# Altium schematic sheet Multiplexed_Row.SchDoc: Multiplexed Row
size A4; DrawnBy: Brandon Skarka; Revision: 0; SheetNumber: 2; SheetTotal: 3
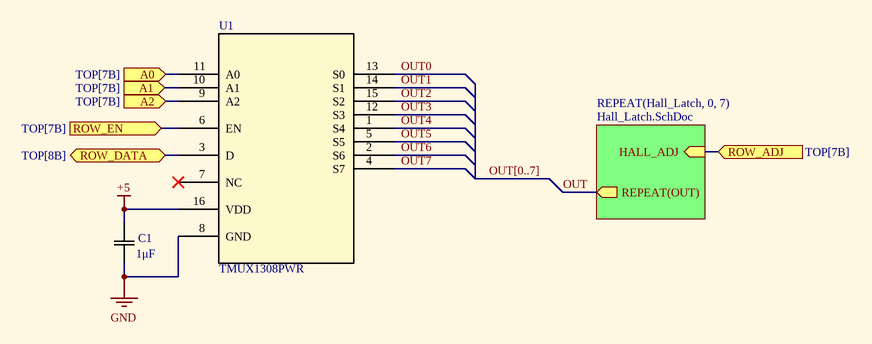
[diagram p0: Multiplexed_Row.SchDoc]

## Parts
C1  1μF  [CAP_CL10_SAM]
U1  TMUX1308PWR  [TSSOP16_PW_TEX]

## Sub-sheets
REPEAT(Hall_Latch, 0, 7) = Hall_Latch.SchDoc: REPEAT(OUT) (out), HALL_ADJ (in)

## Ports
A0 (in, see TOP[7B]), A1 (in, see TOP[7B]), A2 (in, see TOP[7B]), ROW_ADJ (in, see TOP[7B]), ROW_DATA (bidir, see TOP[8B]), ROW_EN (in, see TOP[7B])

## Nets
+5: C1.2 U1.16(VDD)
GND: C1.1 U1.8(GND)
A0: U1.11(A0) ; port A0
A1: U1.10(A1) ; port A1
A2: U1.9(A2) ; port A2
OUT: sheet REPEAT(Hall_Latch, 0, 7)/REPEAT(OUT)
OUT0: U1.13(S0)
OUT1: U1.14(S1)
OUT2: U1.15(S2)
OUT3: U1.12(S3)
OUT4: U1.1(S4)
OUT5: U1.5(S5)
OUT6: U1.2(S6)
OUT7: U1.4(S7)
ROW_ADJ: port ROW_ADJ, sheet REPEAT(Hall_Latch, 0, 7)/HALL_ADJ
ROW_DATA: U1.3(D) ; port ROW_DATA
ROW_EN: U1.6(EN) ; port ROW_EN

Not connected (* = marked no-connect by the designer): U1 7(NC)*

## Buses and harness runs
bus OUT[0..7]

## Library data of the parts
C1 = CL10B104KB8NNWC: No Description Available; Mfr_Name: Samsung; Digi-Key_Part_Number_3: 1276-1935-6-ND; Digi-Key_Part_Number_2: 1276-1935-1-ND; Digi-Key_Part_Number_1: 1276-1935-2-ND; Supplier 1: Digi-Key; Supplier Part Number 1: 1276-1935-6-ND; Supplier 2: Mouser; Supplier Part Number 2: 187-CL10B104KB8NNWC
U1 = TMUX1308PWR: No Description Available; Mfr_Name: Texas Instruments; RefDes: RefDes; Type: Type; Supplier 1: Mouser; Supplier Part Number 1: 595-TMUX1308PWR; Supplier 2: Digi-Key; Supplier Part Number 2: 296-TMUX1308PWRCT-ND